# EAGLE design moids2_0.1 (EAGLE 9.6.2)
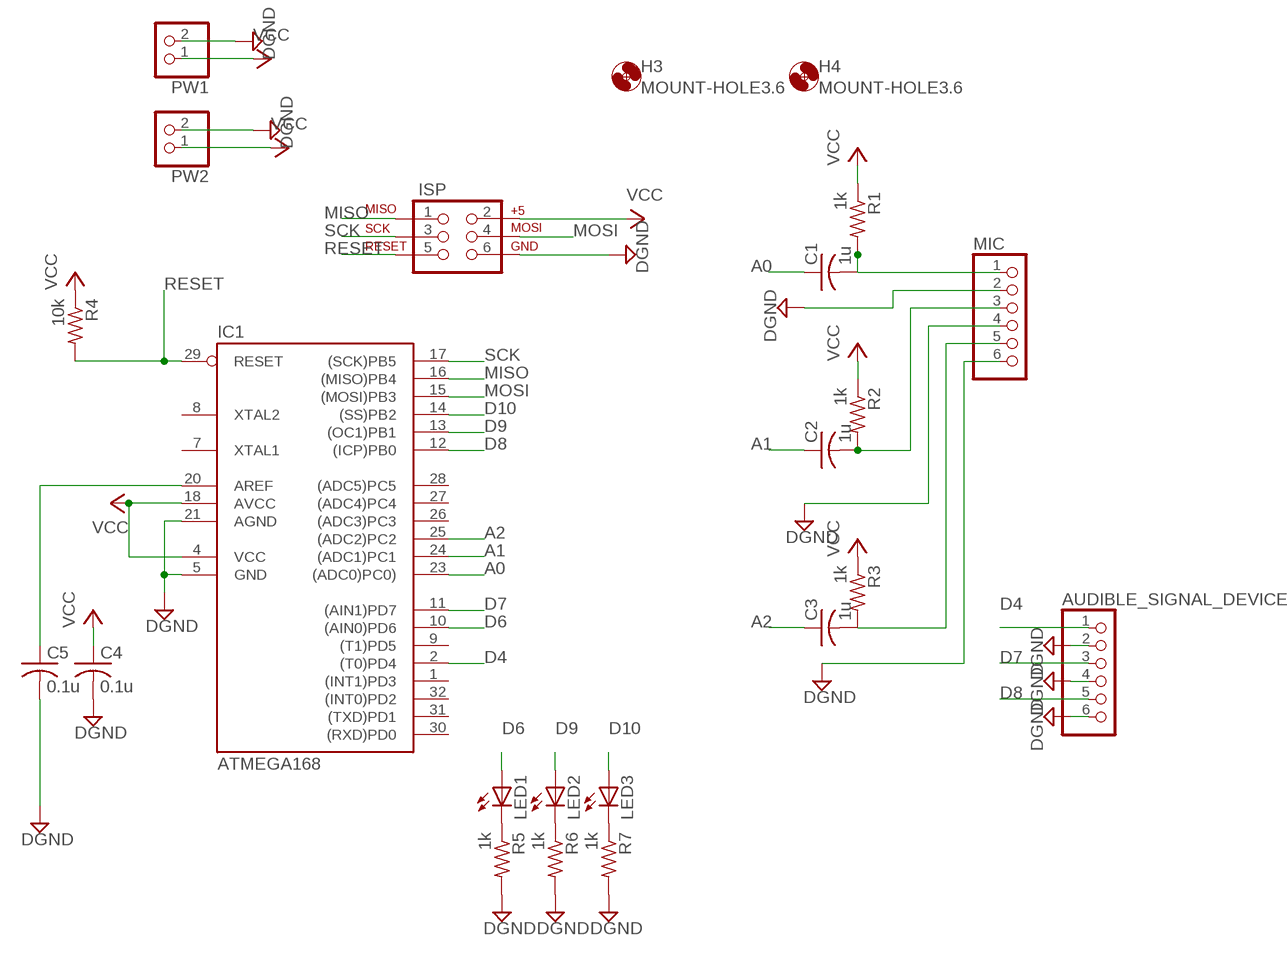
[diagram p0: schematic, sheet 1]

## Parts
AUDIBLE_SIGNAL_DEVICE  PINHD-1X6  [1X06]
C1  1u  C-USC1005  [C1005]
C2  1u  C-USC1005  [C1005]
C3  1u  C-USC1005  [C1005]
C4  0.1u  C-USC1005  [C1005]
C5  0.1u  C-USC1005  [C1005]
H3  MOUNT-HOLE3.6  [3,6]
H4  MOUNT-HOLE3.6  [3,6]
IC1  ATMEGA168  AT90S4433A  [TQFP32-08]
ISP  AVR_SPI_PRG_6PTH  [2X3]
LED1  LEDCHIPLED_1206  [CHIPLED_1206]
LED2  LEDCHIPLED_1206  [CHIPLED_1206]
LED3  LEDCHIPLED_1206  [CHIPLED_1206]
MIC  PINHD-1X6  [1X06]
PW1  PINHD-1X2  [1X02]
PW2  PINHD-1X2  [1X02]
R1  1k  R-US_R1005  [R1005]
R2  1k  R-US_R1005  [R1005]
R3  1k  R-US_R1005  [R1005]
R4  10k  R-US_R1005  [R1005]
R5  1k  R-US_R1005  [R1005]
R6  1k  R-US_R1005  [R1005]
R7  1k  R-US_R1005  [R1005]

## Nets
A0: C1.1 IC1.23((ADC0)PC0))
A1: C2.1 IC1.24((ADC1)PC1)
A2: C3.1 IC1.25((ADC2)PC2)
AREF: C5.1 IC1.20(AREF)
D4: AUDIBLE_SIGNAL_DEVICE.1 IC1.2((T0)PD4)
D6: IC1.10((AIN0)PD6) LED1.A
D7: AUDIBLE_SIGNAL_DEVICE.3 IC1.11((AIN1)PD7)
D8: AUDIBLE_SIGNAL_DEVICE.5 IC1.12((ICP)PB0)
D9: IC1.13((OC1)PB1) LED2.A
D10: IC1.14((SS)PB2) LED3.A
DGND: AUDIBLE_SIGNAL_DEVICE.2 AUDIBLE_SIGNAL_DEVICE.4 AUDIBLE_SIGNAL_DEVICE.6 C4.2 C5.2 IC1.5(GND) IC1.21(AGND) ISP.6 MIC.2 MIC.4 MIC.6 PW1.2 PW2.2 R5.2 R6.2 R7.2
MISO: IC1.16((MISO)PB4) ISP.1
MOSI: IC1.15((MOSI)PB3) ISP.4
N$1: C1.2 MIC.1 R1.2
N$2: C2.2 MIC.3 R2.2
N$4: C3.2 MIC.5 R3.2
N$15: LED1.C R5.1
N$16: LED2.C R6.1
N$17: LED3.C R7.1
RESET: IC1.29(RESET) ISP.5 R4.2
SCK: IC1.17((SCK)PB5) ISP.3
VCC: C4.1 IC1.4(VCC) IC1.18(AVCC) ISP.2 PW1.1 PW2.1 R1.1 R2.1 R3.1 R4.1
Unconnected: IC1.1((INT1)PD3) IC1.7(XTAL1) IC1.8(XTAL2) IC1.9((T1)PD5) IC1.26((ADC3)PC3) IC1.27((ADC4)PC4) IC1.28((ADC5)PC5) IC1.30((RXD)PD0) IC1.31((TXD)PD1) IC1.32((INT0)PD2)

## Library data of the parts
AUDIBLE_SIGNAL_DEVICE MIC = pinhead:PINHD-1X6: PIN HEADER
C1-C5 = rcl:C-US: CAPACITOR, American symbol
H3 H4 = holes:MOUNT-HOLE: MOUNTING HOLE with drill center marker
IC1 = atmel:AT90S4433: MICROCONTROLLER 4 Kbytes FLASH 128 bytes SRAM 256 bytes EEPROM UART 6-channel 10 bit ADC
ISP = SparkFun:AVR_SPI_PRG_6: AVR ISP 6 Pin This is the reduced ISP connector for AVR programming. Common on Arduino. This footprint will take up less PCB space and can be used with a 10-pin to 6-pin adapter such as SKU: BOB-08508
LED1-LED3 = led:LED: LED OSRAM: - CHIPLED LG R971, LG N971, LY N971, LG Q971, LY Q971, LO R971, LY R971 LH N974, LH R974 LS Q976, LO Q976, LY Q976 LO Q996 - Hyper CHIPLED LW Q18S LB Q993, LB Q99A, LB R99A - SideLED LS A670, LO A670, LY A670, LG A670, LP A670 LB A673, LV A673, LT A673, LW A673 LH A674 LY A675 LS A676, LA A676, LO A676, LY A676, LW A676 LS A679, LY A679, LG A679 - Hyper Micro SIDELED® LS Y876, LA Y876, LO Y876, LY Y876 LT Y87S - SmartLED LW L88C, LW L88S LB L89C, LB L89S, LG L890 LS L89K, LO L89K, LY L89K LS L896, LA L896, LO L896, LY L896 - TOPLED LS T670, LO T670, LY T670, LG T670, LP T670 LSG T670, LSP T670, LSY T670, LOP T670, LYG T670 LG T671, LOG T671, LSG T671 LB T673, LV T673, LT T673, LW T673 LH T674 LS T676, LA T676, LO T676, LY T676, LB T676, LH T676, LSB T676, LW T676 LB T67C, LV T67C, LT T67C, LS T67K, LO T67K, LY T67K, LW E67C LS E67B, LA E67B, LO E67B, LY E67B, LB E67C, LV E67C, LT E67C LW T67C LS T679, LY T679, LG T679 LS T770, LO T770, LY T770, LG T770, LP T770 LB T773, LV T773, LT T773, LW T773 LH T774 LS E675, LA E675, LY E675, LS T675 LS T776, LA T776, LO T776, LY T776, LB T776 LHGB T686 LT T68C, LB T68C - Hyper Mini TOPLED® LB M676 - Mini TOPLED Santana® LG M470 LS M47K, LO M47K, LY M47K Source: http://www.osram.convergy.de LUXEON: - LUMILED® LXK2-PW12-R00, LXK2-PW12-S00, LXK2-PW14-U00, LXK2-PW14-V00 LXK2-PM12-R00, LXK2-PM12-S00, LXK2-PM14-U00 LXK2-PE12-Q00, LXK2-PE12-R00, LXK2-PE12-S00, LXK2-PE14-T00, LXK2-PE14-U00 LXK2-PB12-K00, LXK2-PB12-L00, LXK2-PB12-M00, LXK2-PB14-N00, LXK2-PB14-P00, LXK2-PB14-Q00 LXK2-PR12-L00, LXK2-PR12-M00, LXK2-PR14-Q00, LXK2-PR14-R00 LXK2-PD12-Q00, LXK2-PD12-R00, LXK2-PD12-S00 LXK2-PH12-R00, LXK2-PH12-S00 LXK2-PL12-P00, LXK2-PL12-Q00, LXK2-PL12-R00 Source: www.luxeon.com KINGBRIGHT: KA-3528ASYC Source: www.kingbright.com
PW1 PW2 = pinhead:PINHD-1X2: PIN HEADER
R1-R7 = rcl:R-US_: RESISTOR, American symbol

## Board
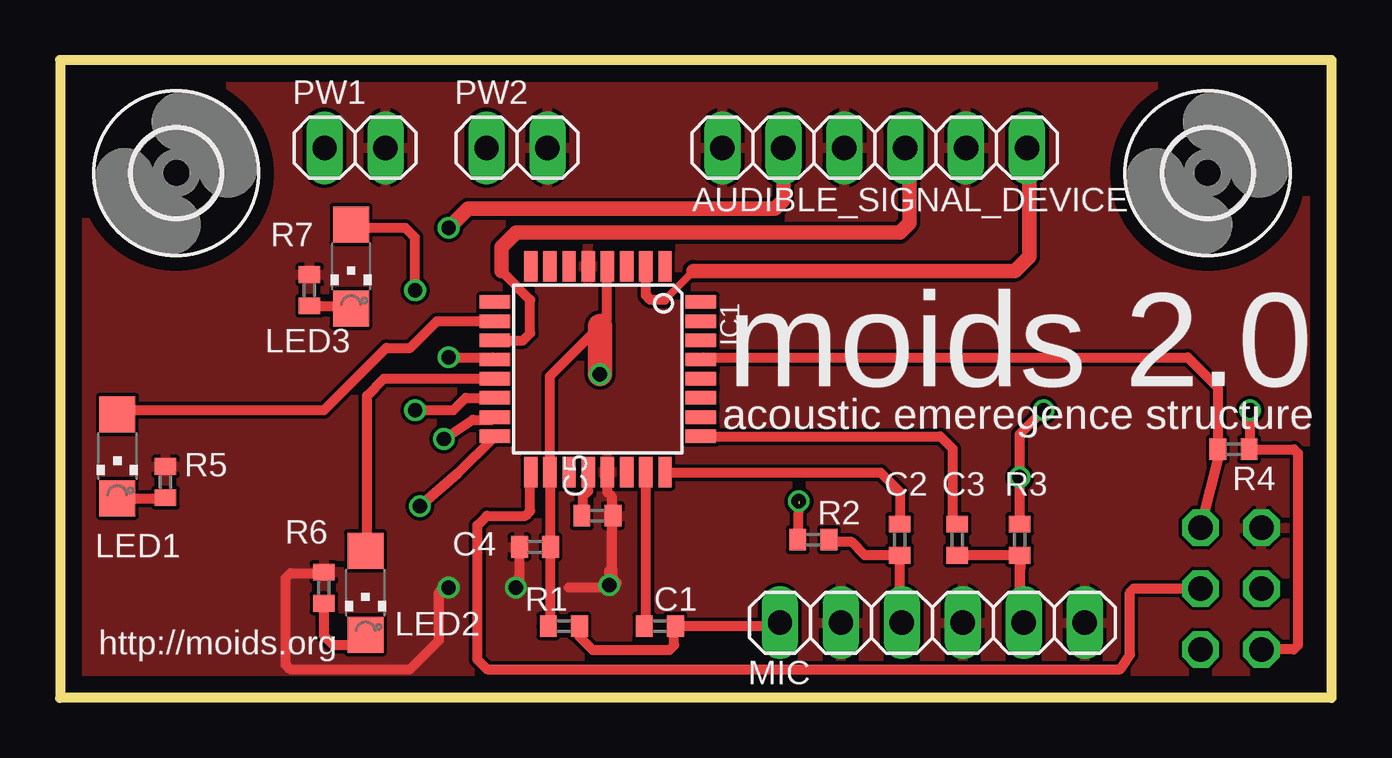
[diagram p1: board, top side]
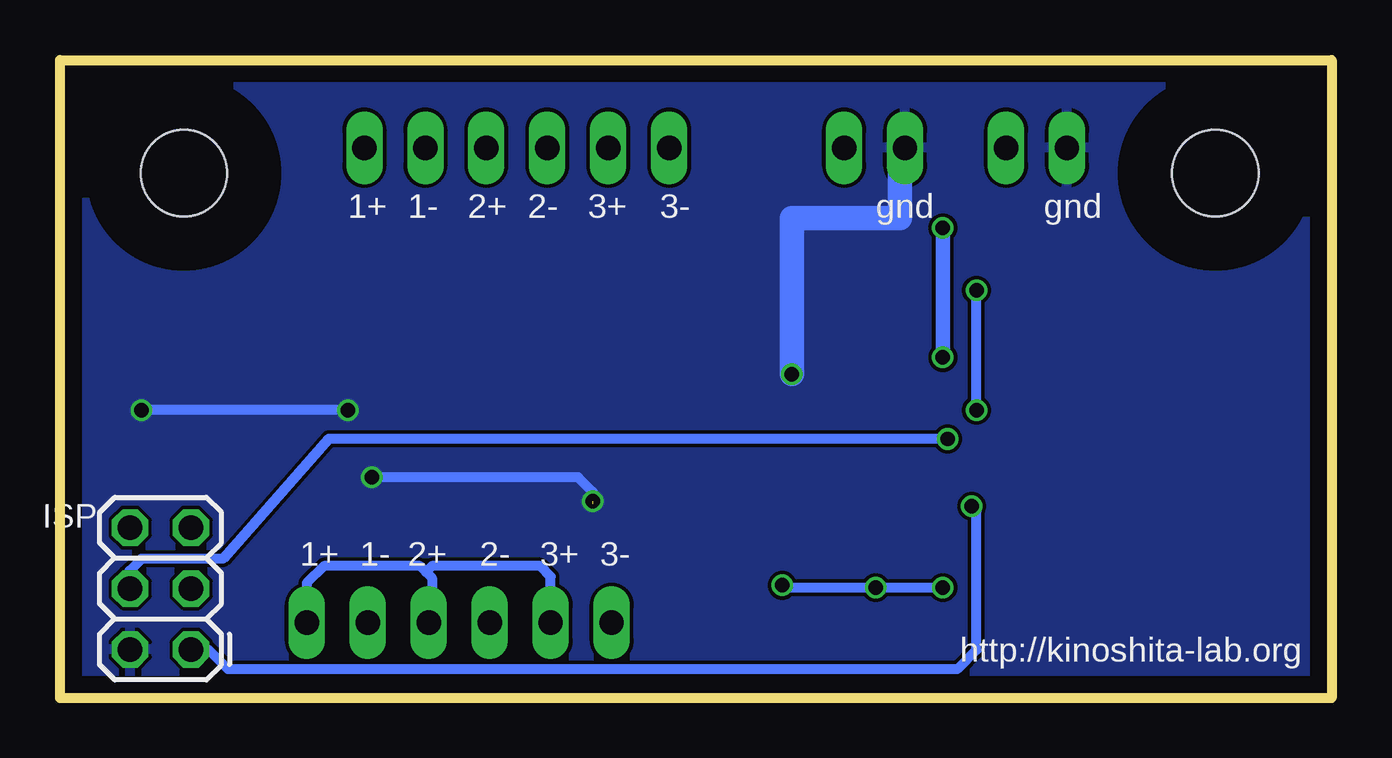
[diagram p2: board, bottom side, seen from below]

Size 53 x 26.6 mm. Coordinates in mm from the lower left corner, seen from the top.
Outline: 53,0 0,0 0,26.6 53,26.6 53,0
Copper layers (1*16): Top 0.035mm / dielectric 1.5mm / Bottom 0.035mm
Design rules "p-ban_min": minimum track width 0.15mm, minimum drill 0.3mm, track to track 0.15mm, track to pad 0.15mm, pad to pad 0.15mm, via to via 0.15mm, smd to smd 0.15mm, copper to edge 0.7mm, drill to drill 0.45mm, minimum pad ring 0.15mm, minimum via ring 0.15mm, stop-mask expansion 4mil, vias tented up to drill 0mil, thermal gap 0.15mm

### Footprints (pad centres in the part's own frame; a part is rotated, then mirrored left to right if it is on the bottom)
1X06 = drill 1.016 long: 1 -6.35,0; 2 -3.81,0; 3 -1.27,0; 4 1.27,0; 5 3.81,0; 6 6.35,0
C1005 = smd 0.7 x 0.9: 1 -0.65,0; 2 0.65,0
3,6 = hole 3.6: 0,0
TQFP32-08 = smd 1.27 x 0.559: 1 -4.293,2.8; 2 -4.293,2; 3 -4.293,1.2; 4 -4.293,0.4; 5 -4.293,-0.4; 6 -4.293,-1.2; 7 -4.293,-2; 8 -4.293,-2.8; 17 4.293,-2.8; 18 4.293,-2; 19 4.293,-1.2; 20 4.293,-0.4; 21 4.293,0.4; 22 4.293,1.2; 23 4.293,2; 24 4.293,2.8 | smd 0.559 x 1.27: 9 -2.8,-4.293; 10 -2,-4.293; 11 -1.2,-4.293; 12 -0.4,-4.293; 13 0.4,-4.293; 14 1.2,-4.293; 15 2,-4.293; 16 2.8,-4.293; 25 2.8,4.293; 26 2,4.293; 27 1.2,4.293; 28 0.4,4.293; 29 -0.4,4.293; 30 -1.2,4.293; 31 -2,4.293; 32 -2.8,4.293
2X3 = drill 1.016 octagon: 1 0,0; 2 0,2.54; 3 2.54,0; 4 2.54,2.54; 5 5.08,0; 6 5.08,2.54
CHIPLED_1206 = smd 1.5 x 1.5: A 0,-1.75; C 0,1.75
1X02 = drill 1.016 long: 1 -1.27,0; 2 1.27,0
R1005 = smd 0.7 x 0.9: 1 -0.65,0; 2 0.65,0

### Placement (x,y rotation side)
AUDIBLE_SIGNAL_DEVICE  33.96,22.94 180 top
C1  25,3 0 top
C2  35,6.6 270 top
C3  37.4,6.6 270 top
C4  19.8,6.3 180 top
C5  22.4,7.6 0 top
H3  47.84,21.89 0 top
H4  4.84,21.89 0 top
IC1  22.42,13.71 270 top
ISP  47.54,2.02 90 bottom
LED1  2.39,10.07 180 top
LED2  12.73,4.39 180 top
LED3  12.13,18 180 top
MIC  36.36,3.14 0 top
PW1  12.3,22.94 0 top
PW2  19.05,22.94 0 top
R1  21,3 0 top
R2  31.4,6.6 0 top
R3  40,6.6 270 top
R4  48.91,10.37 180 top
R5  4.4,9 90 top
R6  11,4.6 90 top
R7  10.4,17 90 top

### Tracks (layer width: path | path; a pad name or v marks a point on that pad's centre or on a via)
A0
  Top 0.406: C1.1 24.4,3 24.42,3.02 IC1.23
A1
  Top 0.406: C2.1 35,8.6 34.2,9.4 25.24,9.4 IC1.24
A2
  Top 0.406: IC1.25 36.69,10.91 37.2,10.4 37.2,7.45 C3.1
AREF
  Top 0.406: IC1.20 22.02,8.62 21.8,8.4 21.8,7.65 C5.1
D4
  Top 0.305: 25.2,16.6 26.4,17.8
  Top 0.406: IC1.2 24.42,16.78 24.6,16.6 25.2,16.6
  Top 0.61: 26.4,17.8 39.8,17.8 40.4,18.4 40.4,22.85 AUDIBLE_SIGNAL_DEVICE.1
D6
  Top 0.406: IC1.10 15.71,15.71 14.6,14.6 13.6,14.6 11,12 2.56,12 LED1.A
D7
  Top 0.406: IC1.11 19.31,14.91 19.6,15.2 19.6,16.6 18.4,17.8
  Top 0.61: AUDIBLE_SIGNAL_DEVICE.3 35.4,22.77 35.4,19.8 35,19.4 19,19.4 18.4,18.8 18.4,17.8
D8  (via drill 0.6 pad 0.41)
  Top 0.406: v16.2,14.2 18.04,14.2 IC1.12
  Top 0.61: AUDIBLE_SIGNAL_DEVICE.5 30.15,20.75 29.8,20.4 17,20.4 v16.2,19.6
  Bottom 0.61: v16.2,14.2 v16.2,19.6
D9
  Top 0.406: IC1.13 13.51,13.31 12.8,12.6 12.8,6.21 LED2.A
D10  (via drill 0.6 pad 0.41)
  Top 0.406: IC1.14 16.91,12.51 16.4,12 v14.8,12 | v14.8,17 14.8,19.2 14.4,19.6 12.28,19.6 LED3.A
  Bottom 0.406: v14.8,12 v14.8,17
DGND  (via drill 0.6 pad 0.41)
  Top 0.406: IC1.21 22.82,8.58 23,8.4 23,7.65 | 23,7.65 C5.2 | 23,5.4 23,5 23.2,4.8 23,4.8 v22.9,4.7 | 23,5.4 23,7.65 | v22.9,4.7 22.8,4.6 21.2,4.6 | C4.2 19.15,4.75 v19,4.6 | v22.9,4.7 22.9,5.3 23,5.4 | v16.2,4.6 16,4.6 15.8,4.4 15.8,2.4 14.6,1.2 9.6,1.2 9.4,1.4 9.4,5 9.6,5.2 10.95,5.2 R6.2
  Bottom 0.406: v22.9,4.7 22.8,4.6 v19,4.6 v16.2,4.6 | MIC.6 42.71,4.79 42,5.5 38,5.5 37.75,5.25 | 37.75,5.25 37.5,5 37.5,3.27 MIC.4 | MIC.2 32.55,5.05 33,5.5 37.5,5.5 37.75,5.25
  pour Top: 1,0.5 52.5,0.5 52.5,26 1,26
MISO  (via drill 0.6 pad 0.41)
  Top 0.406: v15,8 16.6,9.38 IC1.16
  Bottom 0.406: v15,8 14.8,7.8 14.8,2 15.6,1.2 46,1.2 46.8,2 47.32,2 ISP.1
MOSI  (via drill 0.6 pad 0.41)
  Top 0.406: v16,10.8 17.2,11.6 18.02,11.6 IC1.15
  Bottom 0.406: v16,10.8 41.8,10.8 46.2,5.8 49.6,5.8 50.1,5.3 50.1,4.58 ISP.4
N$1
  Top 0.406: MIC.1 29.87,3 25.8,3 25.65,3.15 C1.2 25.6,2.95 25.6,2.2 25.4,2 22.2,2 21.65,2.55 R1.2
N$2
  Top 0.406: MIC.3 35.06,3.14 35,3.2 C2.2 33.55,5.95 33,6.5 32.15,6.5 R2.2
N$4
  Top 0.406: MIC.5 40.06,3.14 40,3.2 40,3.6 | 40,3.6 R3.2 | C3.2 40.05,5.95 40,3.6
N$15
  Top 0.406: LED1.C 4.38,8.32 R5.1
N$16
  Top 0.406: R6.1 11,2.6 11.4,2.2 12.29,2.2 LED2.C
N$17
  Top 0.406: R7.1 12.13,16.35 LED3.C
RESET
  Top 0.406: ISP.5 48.34,10.29 R4.2 48.26,12.94 47,14.2 26.8,14.2 IC1.29
SCK
  Top 0.406: ISP.3 44.76,4.56 44.6,4.4 44.6,1.8 44.2,1.2 17.8,1.2 17.4,1.6 17.4,7.2 17.8,7.6 19.4,7.6 19.6,7.8 19.6,9.4 IC1.17
VCC  (via drill 0.6 pad 0.41)  (1 unrouted)
  Top 0.406: R1.1 20.2,3 20.45,3.25 C4.1 20.45,9.39 IC1.18 20.42,13.42 22.5,15.5 22.8,15.8 22.8,17.98 IC1.4 | ISP.2 51.42,2.02 51.6,2.2 51.6,10.2 51.43,10.37 R4.1 49.6,10.41 v49.6,12 | R3.1 v40,9.2 40,11 v41,12 | R2.1 30.8,8.1
  Top 1.016: 22.5,15.5 v22.5,13.5
  Bottom 0.406: v41,12 v49.6,12 | v30.8,8.2 30.8,8.6 31.4,9.2 39.8,9.2 40,9.4
  Bottom 1.016: PW2.1 18,22.94 18,20 22.5,20 v22.5,13.5
  pour Bottom: 0.5,26 0.5,1 52.5,1 52.5,26

### Text on the board
tPlace: moids 2.0 | acoustic emeregence structure | http://moids.org
bPlace: gnd | gnd | 3- | 3+ | 2- | 2+ | 1- | 1+ | 3- | 3+ | 2- | 2+ | 1- | 1+ | http://kinoshita-lab.org